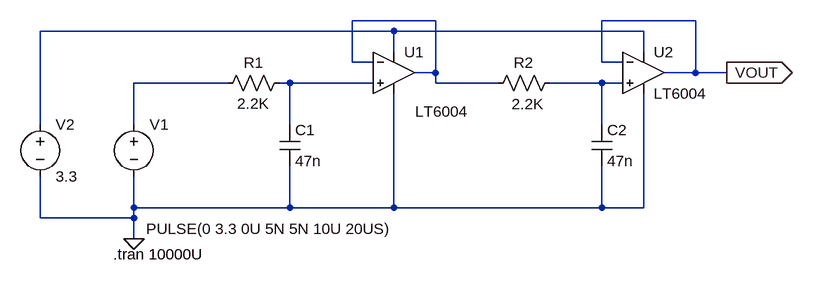
[diagram p0: schematic AUDIO_FILTER_2_Active.asc]
AUDIO_FILTER_2_Active.asc, the LTspice schematic file:
Version 4
SHEET 1 1400 680
WIRE 560 -16 432 -16
WIRE 960 -16 816 -16
WIRE 496 0 -48 0
WIRE 880 0 496 0
WIRE 496 32 496 0
WIRE 880 32 880 0
WIRE 432 48 432 -16
WIRE 464 48 432 48
WIRE 816 48 816 -16
WIRE 848 48 816 48
WIRE 560 64 560 -16
WIRE 560 64 528 64
WIRE 960 64 960 -16
WIRE 960 64 912 64
WIRE 1008 64 960 64
WIRE 240 80 96 80
WIRE 336 80 320 80
WIRE 464 80 336 80
WIRE 560 80 560 64
WIRE 656 80 560 80
WIRE 816 80 736 80
WIRE 848 80 816 80
WIRE -48 144 -48 0
WIRE 96 144 96 80
WIRE 336 144 336 80
WIRE 816 144 816 80
WIRE 96 272 96 224
WIRE 336 272 336 208
WIRE 336 272 96 272
WIRE 496 272 496 96
WIRE 496 272 336 272
WIRE 816 272 816 208
WIRE 816 272 496 272
WIRE 880 272 880 96
WIRE 880 272 816 272
WIRE -48 288 -48 224
WIRE 96 288 96 272
WIRE 96 288 -48 288
WIRE 96 320 96 288
FLAG 96 320 0
FLAG 1008 64 VOUT
IOPIN 1008 64 Out
SYMBOL voltage 96 128 R0
WINDOW 3 19 177 Left 2
WINDOW 123 0 0 Left 0
WINDOW 39 0 0 Left 0
SYMATTR Value PULSE(0 3.3 0U 5N 5N 10U 20US)
SYMATTR InstName V1
SYMBOL res 336 64 R90
WINDOW 0 0 56 VBottom 2
WINDOW 3 32 56 VTop 2
SYMATTR InstName R1
SYMATTR Value 2.2K
SYMBOL res 752 64 R90
WINDOW 0 0 56 VBottom 2
WINDOW 3 33 50 VTop 2
SYMATTR InstName R2
SYMATTR Value 2.2K
SYMBOL cap 320 144 R0
SYMATTR InstName C1
SYMATTR Value 47n
SYMBOL cap 800 144 R0
SYMATTR InstName C2
SYMATTR Value 47n
SYMBOL Opamps\\LT6004 496 64 R0
WINDOW 3 33 60 Left 2
SYMATTR InstName U1
SYMBOL voltage -48 128 R0
WINDOW 123 0 0 Left 0
WINDOW 39 0 0 Left 0
SYMATTR InstName V2
SYMATTR Value 3.3
SYMBOL Opamps\\LT6004 880 64 R0
SYMATTR InstName U2
TEXT 64 344 Left 2 !.tran 10000U

The netlist it stands for:
* AUDIO_FILTER_2_Active.asc
V1 N003 0 PULSE(0 3.3 0U 5N 5N 10U 20US)
R1 N004 N003 2.2K
R2 N005 N001 2.2K
C1 N004 0 47n
C2 N005 0 47n
* U1: LT6004 (symbol Opamps\LT6004 not available, pins judged from their places): In+=N004 In-=N001 V+=N002 V-=0 OUT=N001
V2 N002 0 3.3
* U2: LT6004 (symbol Opamps\LT6004 not available, pins judged from their places): In+=N005 In-=VOUT V+=N002 V-=0 OUT=VOUT
.tran 10000U
.backanno
.end